# Altium schematic sheet Boot.SchDoc
size A
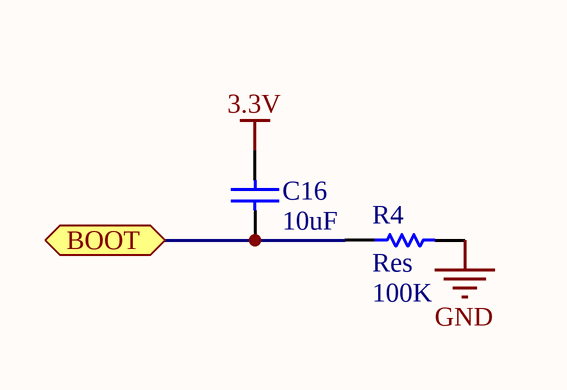
[diagram p0: Boot.SchDoc]

## Parts
C16  value 10uF  [2012[0805]]  (hidden comment: Cap_UP)
R4  Res  value 100K  [2012[0805]]

## Ports
BOOT (bidir)

## Nets
3.3V: C16.1
GND: R4.2
BOOT: C16.2 R4.1 ; port BOOT

## Library data of the parts
C16 = Cap_UP: Capacitor; Published: 8-Jun-2000; LatestRevisionDate: 17-Jul-2002; LatestRevisionNote: Re-released for DXP Platform.; PackageReference: RAD-0.3; Publisher: Altium Limited
R4 = Res: Semiconductor Resistor; Published: 8-Jun-2000; LatestRevisionDate: 17-Jul-2002; LatestRevisionNote: Re-released for DXP Platform.; PackageReference: AXIAL-0.5; Publisher: Altium Limited